# Altium schematic sheet DAC_Interface.SchDoc
size A4; SheetNumber: 8; SheetTotal: 16
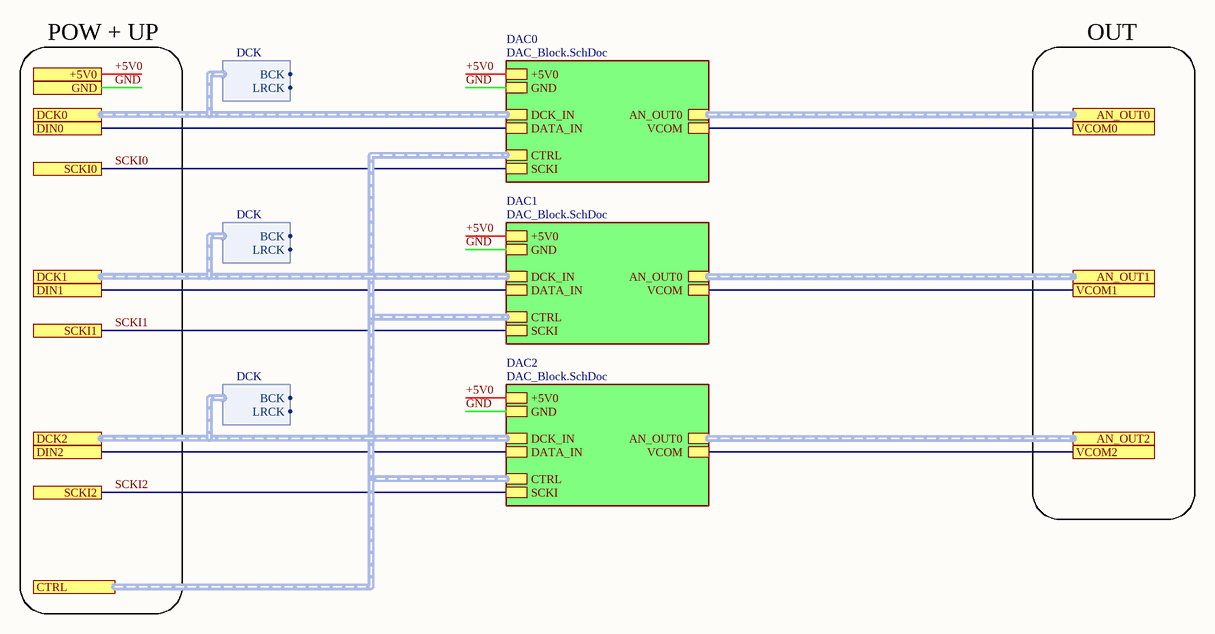
[diagram p0: DAC_Interface.SchDoc]

## Sub-sheets
DAC0 = DAC_Block.SchDoc: GND, +5V0, VCOM, DATA_IN, DCK_IN (harness DCK), SCKI, AN_OUT0 (harness AN), CTRL (harness DAC_CTRL)
DAC1 = DAC_Block.SchDoc: GND, +5V0, VCOM, DATA_IN, DCK_IN (harness DCK), SCKI, AN_OUT0 (harness AN), CTRL (harness DAC_CTRL)
DAC2 = DAC_Block.SchDoc: GND, +5V0, VCOM, DATA_IN, DCK_IN (harness DCK), SCKI, AN_OUT0 (harness AN), CTRL (harness DAC_CTRL)

## Ports
+5V0 (see AudioDSP-v3.1.1_top[5B], DAC_Block[1B], LPF_Block[1B], LPF_Interface[1A], POW_Block[4A]), AN_OUT0 (harness AN, see AudioDSP-v3.1.1_top[6B], DAC_Block[4B]), AN_OUT1 (harness AN, see AudioDSP-v3.1.1_top[6B]), AN_OUT2 (harness AN, see AudioDSP-v3.1.1_top[6C]), CTRL (harness DAC_CTRL, see AudioDSP-v3.1.1_top[6B], DAC_Block[1B]), DCK0 (harness DCK, see AudioDSP-v3.1.1_top[5B]), DCK1 (harness DCK, see AudioDSP-v3.1.1_top[5B]), DCK2 (harness DCK, see AudioDSP-v3.1.1_top[5C]), DIN0 (see AudioDSP-v3.1.1_top[5B]), DIN1 (see AudioDSP-v3.1.1_top[5B]), DIN2 (see AudioDSP-v3.1.1_top[5C]), GND (see AudioDSP-v3.1.1_top[5B], ADC_Block[1B], ADC_Interface[1A], CLK_Block[1B], CTRL_Connectors[1A], DAC_Block[1B], DSP_Block[1A], DSP_Interface[1A], IN_Connectors[3A], LPF_Block[1B], LPF_Interface[1B], MCU_Block[1B], OUT_Connectors[3B], POW_Block[1A], THM_Block[1B]), SCKI0 (see AudioDSP-v3.1.1_top[5C], ADC_Interface[1B]), SCKI1 (see AudioDSP-v3.1.1_top[5C], ADC_Interface[1C]), SCKI2 (see AudioDSP-v3.1.1_top[5C], ADC_Interface[1C]), VCOM0 (see AudioDSP-v3.1.1_top[6B], LPF_Interface[1B]), VCOM1 (see AudioDSP-v3.1.1_top[6B], LPF_Interface[1B]), VCOM2 (see AudioDSP-v3.1.1_top[6C], LPF_Interface[1C])

## Harnesses
DCK: BCK, LRCK

## Nets
+5V0: port +5V0, sheet DAC0/+5V0, sheet DAC1/+5V0, sheet DAC2/+5V0
DIN0: port DIN0, sheet DAC0/DATA_IN
DIN1: port DIN1, sheet DAC1/DATA_IN
DIN2: port DIN2, sheet DAC2/DATA_IN
GND: port GND, sheet DAC0/GND, sheet DAC1/GND, sheet DAC2/GND
SCKI0: port SCKI0, sheet DAC0/SCKI
SCKI1: port SCKI1, sheet DAC1/SCKI
SCKI2: port SCKI2, sheet DAC2/SCKI
VCOM0: port VCOM0, sheet DAC0/VCOM
VCOM1: port VCOM1, sheet DAC1/VCOM
VCOM2: port VCOM2, sheet DAC2/VCOM

## Buses and harness runs
harness port AN_OUT0 = sheet DAC0/AN_OUT0
harness port AN_OUT1 = sheet DAC1/AN_OUT0
harness port AN_OUT2 = sheet DAC2/AN_OUT0
harness port CTRL = sheet DAC0/CTRL = sheet DAC1/CTRL = sheet DAC2/CTRL
harness port DCK0 = sheet DAC0/DCK_IN
harness port DCK1 = sheet DAC1/DCK_IN
harness port DCK2 = sheet DAC2/DCK_IN

## Notes on the sheet
- POW + UP
- OUT